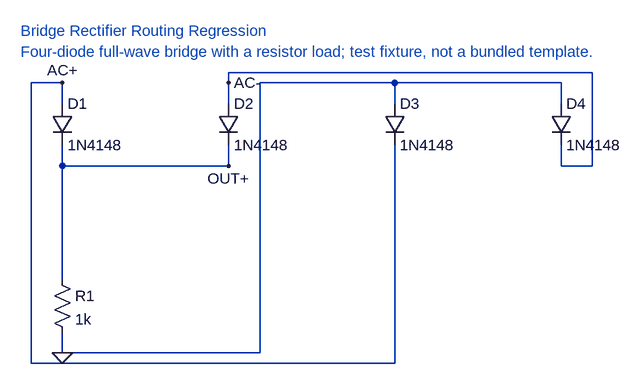
[diagram p0: schematic bridge_rectifier.asc]
bridge_rectifier.asc, the LTspice schematic file:
Version 4
SHEET 1 1200 800
TEXT 16 16 Left 2 ;Bridge Rectifier Routing Regression
TEXT 16 48 Left 2 ;Four-diode full-wave bridge with a resistor load; test fixture, not a bundled template.
SYMBOL diode 64 128 R0
SYMATTR InstName D1
SYMATTR Value 1N4148
SYMBOL diode 320 128 R0
SYMATTR InstName D2
SYMATTR Value 1N4148
SYMBOL diode 576 128 R0
SYMATTR InstName D3
SYMATTR Value 1N4148
SYMBOL diode 832 128 R0
SYMATTR InstName D4
SYMATTR Value 1N4148
SYMBOL res 64 384 R0
SYMATTR InstName R1
SYMATTR Value 1k
FLAG 80 96 AC+
WIRE 32 96 32 528
WIRE 32 96 80 96
WIRE 32 528 592 528
WIRE 80 96 80 128
WIRE 592 192 592 224
WIRE 592 224 592 528
FLAG 336 96 AC-
WIRE 336 80 336 96
WIRE 336 80 896 80
WIRE 336 96 336 128
WIRE 848 192 848 224
WIRE 848 224 896 224
WIRE 896 80 896 224
FLAG 336 224 OUT+
WIRE 80 192 80 224
WIRE 80 224 80 368
WIRE 80 224 336 224
WIRE 80 368 80 400
WIRE 336 192 336 224
FLAG 80 512 0
WIRE 80 480 80 512
WIRE 80 512 384 512
WIRE 384 96 384 512
WIRE 384 96 592 96
WIRE 592 96 592 128
WIRE 592 96 848 96
WIRE 848 96 848 128

The netlist it stands for:
* bridge_rectifier.asc
D1 AC+ OUT+ 1N4148
D2 AC- OUT+ 1N4148
D3 0 AC+ 1N4148
D4 0 AC- 1N4148
R1 OUT+ 0 1k
.model D D
.lib standard.dio
* Bridge Rectifier Routing Regression
* Four-diode full-wave bridge with a resistor load; test fixture, not a bundled template.
.backanno
.end